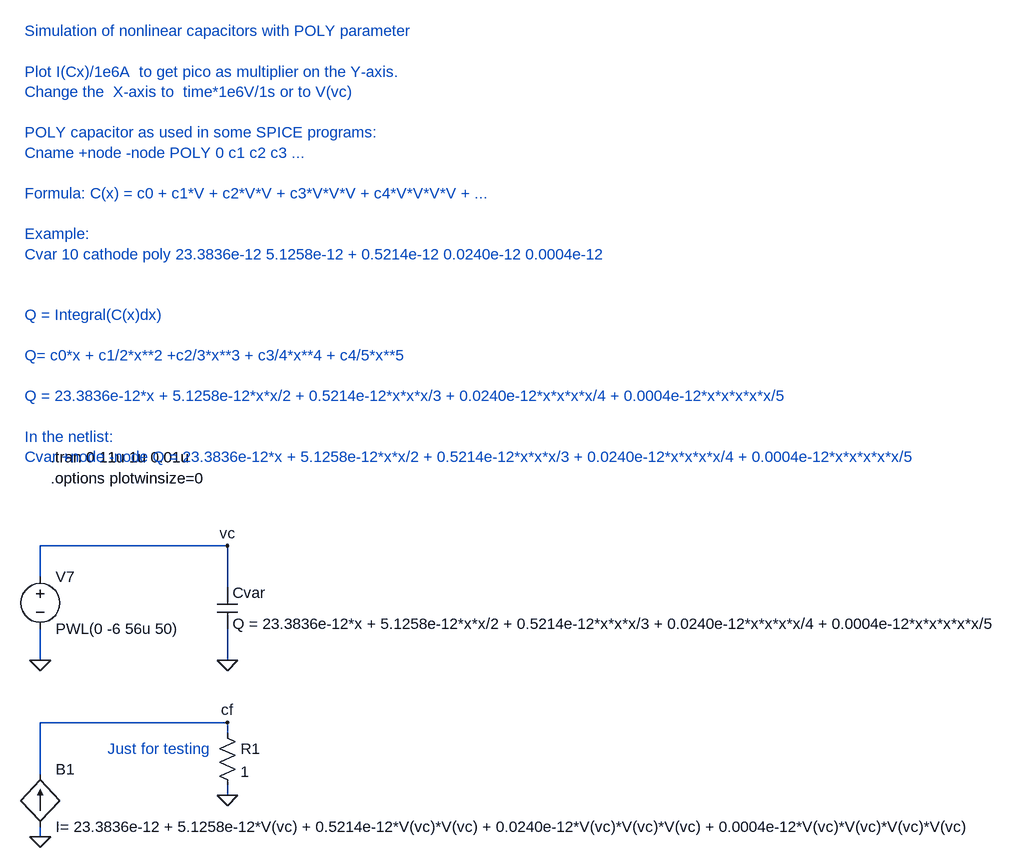
[diagram p0: schematic nonlinear_capacitance_poly.asc]
nonlinear_capacitance_poly.asc, the LTspice schematic file:
Version 4
SHEET 1 1856 1860
WIRE 352 -176 64 -176
WIRE 64 -128 64 -176
WIRE 352 -112 352 -176
WIRE 64 0 64 -48
WIRE 352 0 352 -48
WIRE 352 96 64 96
WIRE 352 112 352 96
WIRE 64 176 64 96
WIRE 352 208 352 192
WIRE 64 272 64 256
FLAG 64 0 0
FLAG 352 0 0
FLAG 352 -176 vc
FLAG 352 208 0
FLAG 352 96 cf
FLAG 64 272 0
SYMBOL cap 336 -112 R0
SYMATTR InstName Cvar
SYMATTR Value Q = 23.3836e-12*x + 5.1258e-12*x*x/2 + 0.5214e-12*x*x*x/3 + 0.0240e-12*x*x*x*x/4 + 0.0004e-12*x*x*x*x*x/5
SYMBOL voltage 64 -144 R0
WINDOW 123 0 0 Left 0
WINDOW 39 0 0 Left 0
SYMATTR InstName V7
SYMATTR Value PWL(0 -6 56u 50)
SYMBOL bi 64 256 M180
WINDOW 0 24 88 Left 0
WINDOW 3 24 0 Left 0
SYMATTR InstName B1
SYMATTR Value I= 23.3836e-12 + 5.1258e-12*V(vc) + 0.5214e-12*V(vc)*V(vc) + 0.0240e-12*V(vc)*V(vc)*V(vc) + 0.0004e-12*V(vc)*V(vc)*V(vc)*V(vc)
SYMBOL res 336 96 R0
SYMATTR InstName R1
SYMATTR Value 1
TEXT 80 -312 Left 0 !.tran 0 11u 1u 0.01u
TEXT 40 -968 Left 0 ;Simulation of nonlinear capacitors with POLY parameter\n \nPlot I(Cx)/1e6A  to get pico as multiplier on the Y-axis.\nChange the  X-axis to  time*1e6V/1s or to V(vc)\n \nPOLY capacitor as used in some SPICE programs:\nCname +node -node POLY 0 c1 c2 c3 ...\n \nFormula: C(x) = c0 + c1*V + c2*V*V + c3*V*V*V + c4*V*V*V*V + ...\n \nExample: \nCvar 10 cathode poly 23.3836e-12 5.1258e-12 + 0.5214e-12 0.0240e-12 0.0004e-12\n \n \nQ = Integral(C(x)dx)   \n \nQ= c0*x + c1/2*x**2 +c2/3*x**3 + c3/4*x**4 + c4/5*x**5\n \nQ = 23.3836e-12*x + 5.1258e-12*x*x/2 + 0.5214e-12*x*x*x/3 + 0.0240e-12*x*x*x*x/4 + 0.0004e-12*x*x*x*x*x/5\n \nIn the netlist:\nCvar +node -node Q = 23.3836e-12*x + 5.1258e-12*x*x/2 + 0.5214e-12*x*x*x/3 + 0.0240e-12*x*x*x*x/4 + 0.0004e-12*x*x*x*x*x/5
TEXT 80 -280 Left 0 !.options plotwinsize=0
TEXT 168 136 Left 0 ;Just for testing

The netlist it stands for:
* nonlinear_capacitance_poly.asc
Cvar vc 0 Q = 23.3836e-12*x + 5.1258e-12*x*x/2 + 0.5214e-12*x*x*x/3 + 0.0240e-12*x*x*x*x/4 + 0.0004e-12*x*x*x*x*x/5
V7 vc 0 PWL(0 -6 56u 50)
B1 0 cf I= 23.3836e-12 + 5.1258e-12*V(vc) + 0.5214e-12*V(vc)*V(vc) + 0.0240e-12*V(vc)*V(vc)*V(vc) + 0.0004e-12*V(vc)*V(vc)*V(vc)*V(vc)
R1 cf 0 1
.tran 0 11u 1u 0.01u
* Simulation of nonlinear capacitors with POLY parameter
* Plot I(Cx)/1e6A  to get pico as multiplier on the Y-axis.
* Change the  X-axis to  time*1e6V/1s or to V(vc)
* POLY capacitor as used in some SPICE programs:
* Cname +node -node POLY 0 c1 c2 c3 ...
* Formula: C(x) = c0 + c1*V + c2*V*V + c3*V*V*V + c4*V*V*V*V + ...
* Example:
* Cvar 10 cathode poly 23.3836e-12 5.1258e-12 + 0.5214e-12 0.0240e-12 0.0004e-12
* Q = Integral(C(x)dx)
* Q= c0*x + c1/2*x**2 +c2/3*x**3 + c3/4*x**4 + c4/5*x**5
* Q = 23.3836e-12*x + 5.1258e-12*x*x/2 + 0.5214e-12*x*x*x/3 + 0.0240e-12*x*x*x*x/4 + 0.0004e-12*x*x*x*x*x/5
* In the netlist:
* Cvar +node -node Q = 23.3836e-12*x + 5.1258e-12*x*x/2 + 0.5214e-12*x*x*x/3 + 0.0240e-12*x*x*x*x/4 + 0.0004e-12*x*x*x*x*x/5
.options plotwinsize=0
* Just for testing
.backanno
.end